# EAGLE design PEC16 straddle (EAGLE 6.5.0)
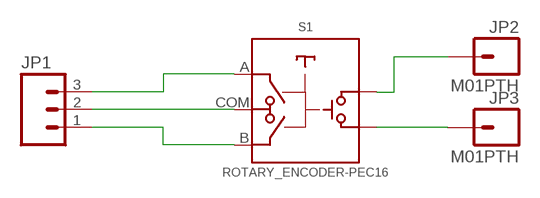
[diagram p0: schematic, sheet 1]

## Parts
JP1  M03PTH  [1X03]
JP2  M01PTH  [1X01]
JP3  M01PTH  [1X01]
S1  ROTARY_ENCODER-PEC16  [PEC16-2XXX]

## Nets
N$2: JP3.1 S1.P$5
N$3: JP1.3 S1.A
N$4: JP1.2 S1.COM
N$5: JP1.1 S1.B
N$6: JP2.1 S1.P$4

## Library data of the parts
JP1 = SparkFun-Connectors:M03: Header 3 Standard 3-pin 0.1" header. Use with straight break away headers (SKU : PRT-00116), right angle break away headers (PRT-00553), swiss pins (PRT-00743), machine pins (PRT-00117), and female headers (PRT-00115). Molex polarized connector foot print use with SKU : PRT-08232 with associated crimp pins and housings.
JP2 JP3 = SparkFun-Connectors:M01: Header 1 Standard 1-pin 0.1" header. Use with straight break away headers (SKU : PRT-00116), right angle break away headers (PRT-00553), swiss pins (PRT-00743), machine pins (PRT-00117), and female headers (PRT-00115).
S1 = ChipsParts:ROTARY_ENCODER: Rotary Encoder with push-button switch. Bourns PEC-16 right-angle mount. DigiKey # PEC16-2215F-S0024-ND TT Electronics EN12 right-angle mount. Digikey # 987-1198-ND

## Board
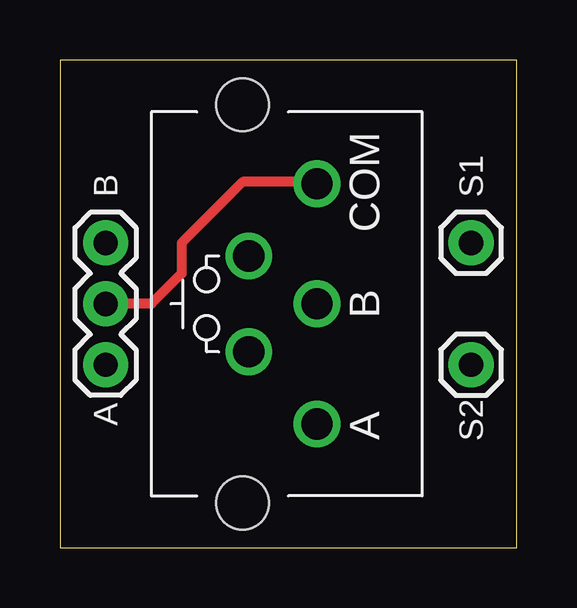
[diagram p1: board, top side]
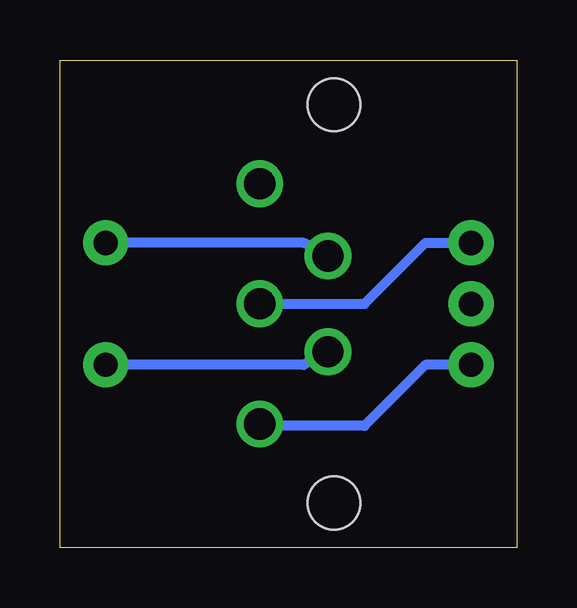
[diagram p2: board, bottom side, seen from below]

Size 19.05 x 20.32 mm. Coordinates in mm from the lower left corner, seen from the top.
Outline: 0,0 19.05,0 19.05,20.32 0,20.32 0,0
Copper layers (1*16): Top 0.035mm / dielectric 1.5mm / Bottom 0.035mm
Design rules "default": minimum track width 10mil, minimum drill 24mil, track to track 8mil, track to pad 8mil, pad to pad 8mil, via to via 8mil, smd to smd 8mil, copper to edge 40mil, drill to drill 8mil, minimum pad ring 10mil, minimum via ring 8mil, stop-mask expansion 4mil, vias tented up to drill 0mil, thermal gap 10mil

### Footprints (pad centres in the part's own frame; a part is rotated, then mirrored left to right if it is on the bottom)
1X03 = drill 1.016 pad 1.88: 1 0,0; 2 2.54,0; 3 5.08,0
1X01 = drill 1.016 pad 1.88: 1 0,0
PEC16-2XXX = drill 1.3: A -5.004,-3.099; B 0,-3.099; COM 5.004,-3.099; P$4 -1.994,-0.254; P$5 1.994,-0.254 | hole 2.2: -8.301,0; 8.301,0

### Placement (x,y rotation side)
JP1  1.91,12.7 270 top
JP2  17.14,7.62 0 top
JP3  17.14,12.7 0 top
S1  7.62,10.16 90 top

### Tracks (layer width: path | path; a pad name or v marks a point on that pad's centre or on a via)
N$2
  Bottom 0.406: S1.P$5 8.89,12.7 JP3.1
N$3
  Bottom 0.406: JP1.3 3.81,7.62 6.35,5.08 10.16,5.08 S1.A
N$4
  Top 0.406: S1.COM 10.16,15.24 7.62,15.24 5.08,12.7 5.08,11.43 3.81,10.16 JP1.2
N$5
  Bottom 0.406: S1.B 6.35,10.16 3.81,12.7 JP1.1
N$6
  Bottom 0.406: S1.P$4 8.89,7.62 JP2.1

### Text on the board
tPlace: B | S1 | A | S2